# EAGLE design 30x70-motor-controller (EAGLE 7.7.0)

## Sheet 1 of 2
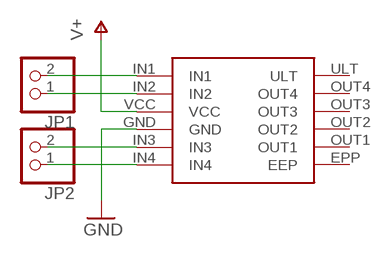
[diagram p0: schematic, sheet 1]

### Parts
JP1  PINHD-1X2/90  [1X02/90]
JP2  PINHD-1X2/90  [1X02/90]
U$1  DRV8833-MODULE  [DRV8833-BRKOUT]

### Nets
GND: U$1.GND ; also sheet 2
N$1: JP2.2 U$1.IN3
N$2: JP2.1 U$1.IN4
N$3: JP1.2 U$1.IN1
N$4: JP1.1 U$1.IN2
V+: U$1.VCC ; also sheet 2
Unconnected: U$1.EPP(EEP) U$1.OUT1 U$1.OUT2 U$1.OUT3 U$1.OUT4 U$1.ULT

## Sheet 2 of 2
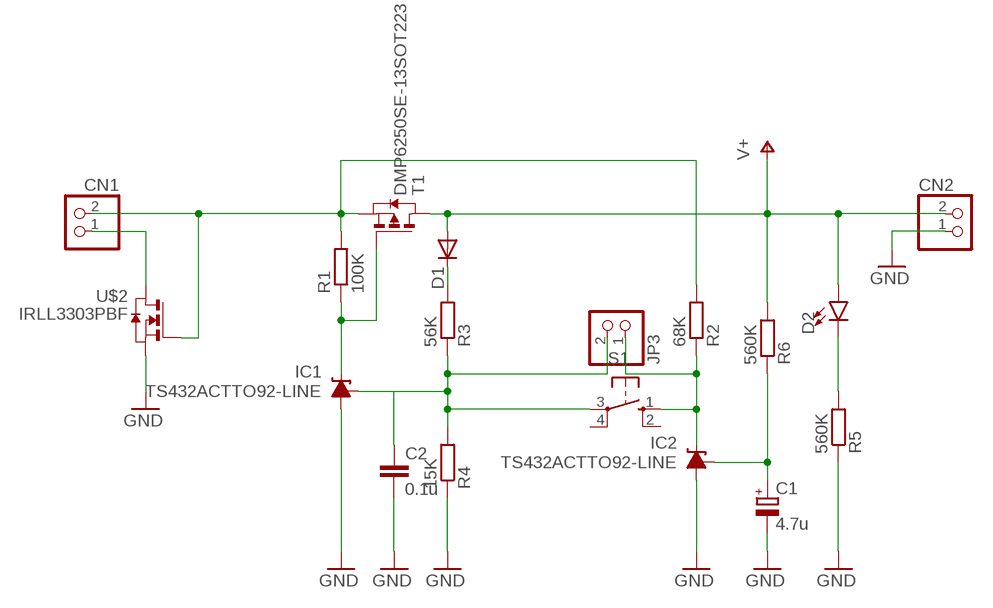
[diagram p1: schematic, sheet 2]

### Parts
C1  4.7u  CPOL-EUE2.5-5  [E2,5-5]
C2  0.1u  C-EU025-024X044  [C025-024X044]
CN1  JST_2PIN-THM-RA  [JST-PH-2-THM-RA]
CN2  JST_2PIN-THM-RA  [JST-PH-2-THM-RA]
D1  DIODE-D-2.5  [D-2.5]
D2  LED-3MM-NO_SILK  [LED_3MM-NS]
IC1  TS432ACTTO92-LINE  [TO92-LINE]
IC2  TS432ACTTO92-LINE  [TO92-LINE]
JP3  PINHD-1X2/90  [1X02/90]
R1  100K  R-EU_0204/5  [0204/5]
R2  68K  R-EU_0204/5  [0204/5]
R3  56K  R-EU_0204/5  [0204/5]
R4  15K  R-EU_0204/2V  [0204V]
R5  560K  R-EU_0204/5  [0204/5]
R6  560K  R-EU_0204/5  [0204/5]
S1  10-XX  [B3F-10XX]
T1  DMP6250SE-13SOT223  [SOT223]
U$2  IRLL3303PBF  [SOT223]

### Nets
GND: C1.- C2.2 CN2.1 IC1.2(A) IC2.2(A) R4.1 R5.1 U$2.3(S) ; also sheet 1
N$5: CN1.2 R1.2 R2.2 T1.3(S) U$2.1(G)
N$6: IC1.1(C) R1.1 T1.1(G)
N$7: CN1.1 U$2.2(D) U$2.4(D)
N$8: C2.1 IC1.3(FB) JP3.2 R3.1 R4.2 S1.3(P)
N$9: IC2.1(C) JP3.1 R2.1 S1.1(S)
N$10: C1.+ IC2.3(FB) R6.1
N$13: D1.C R3.2
N$17: D2.K(C) R5.2
V+: CN2.2 D1.A D2.A R6.2 T1.2(D) T1.4(D) ; also sheet 1
Unconnected: S1.2(S1) S1.4(P1)

## Library data of the parts
C1 = resistor:CPOL-EU: POLARIZED CAPACITOR, European symbol
C2 = resistor:C-EU: CAPACITOR, European symbol
CN1 CN2 = adafruit:JST_2PIN: JST 2-Pin Connectors of various flavors SMT-RA (S2B-PH-SM4) 4UConnector #17311 SMT (B2B-PH-SM4) THM-RA (S2B-PH) THM (B2B-PH)
D1 = diode:DIODE-: DIODE
D2 = SparkFun-LED:LED: LED (Generic) Standard schematic elements and footprints for 5mm, 3mm, 1206, and 0603 sized LEDs. Generic LEDs with no color specified.
IC1 IC2 = assorted:TS432ACT
JP1-JP3 = pinhead:PINHD-1X2: PIN HEADER
R1-R6 = resistor:R-EU_: RESISTOR, European symbol
S1 = switch-omron:10-XX: OMRON SWITCH; MPN: B3F-1000; OC_FARNELL: 176432; OC_NEWARK: 36M3542
T1 = assorted:DMP6250SE-13
U$1 = assorted:DRV8833-MODULE
U$2 = assorted:IRLL3303PBF

## Board
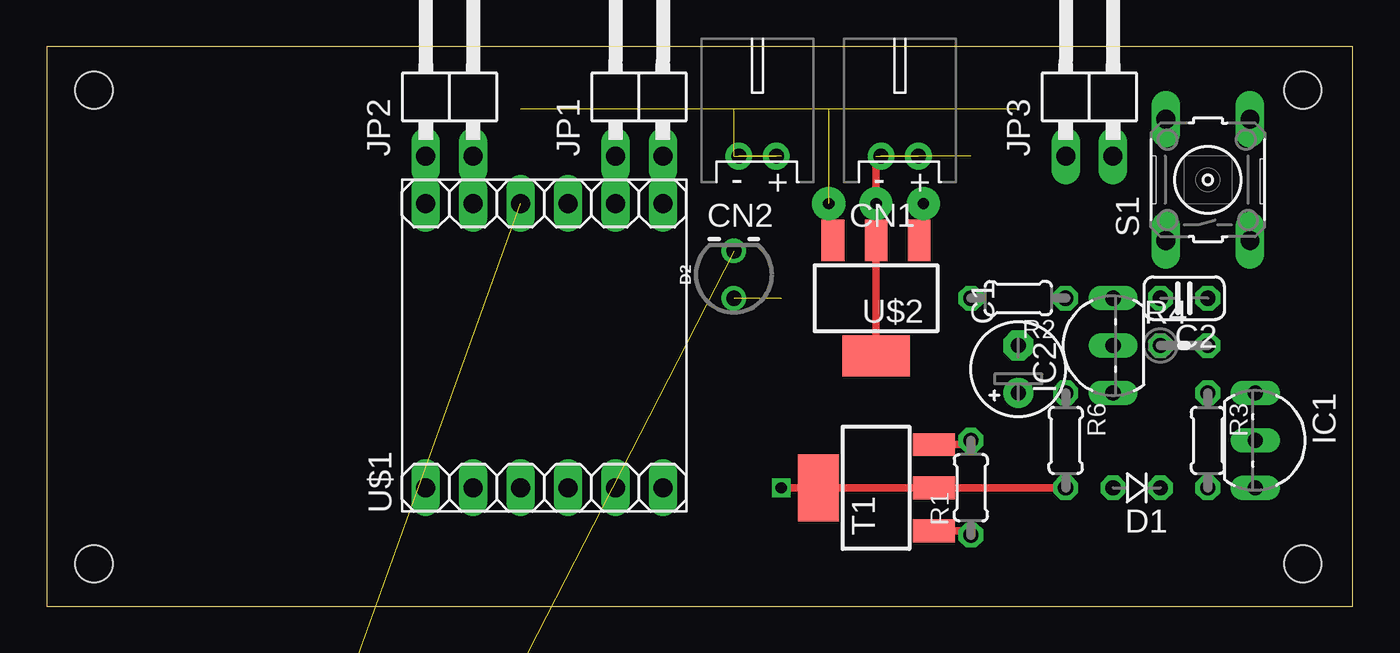
[diagram p2: board, top side]
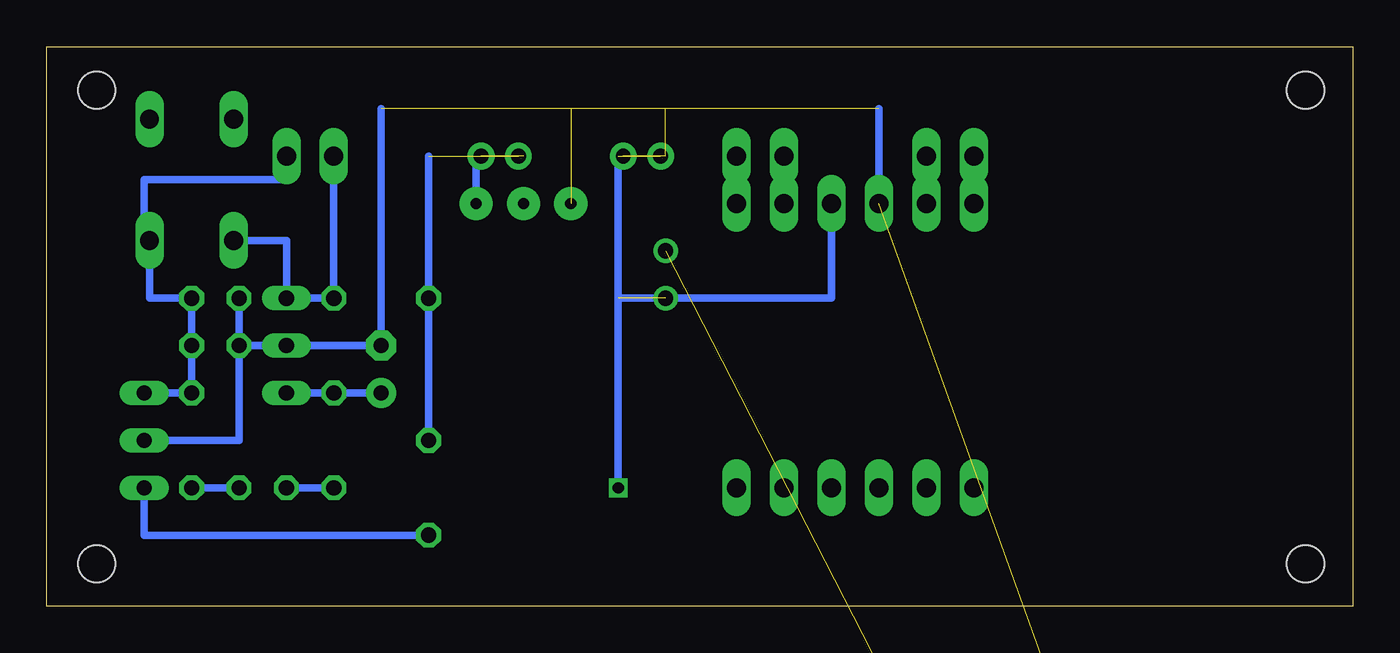
[diagram p3: board, bottom side, seen from below]

Size 70 x 30 mm. Coordinates in mm from the lower left corner, seen from the top.
Outline: 0,0 70,0 70,30 0,30 0,0
Copper layers (1*16): Top 0.035mm / dielectric 1.5mm / Bottom 0.035mm
Design rules "default": minimum track width 10mil, minimum drill 24mil, track to track 8mil, track to pad 8mil, pad to pad 8mil, via to via 8mil, smd to smd 8mil, copper to edge 40mil, drill to drill 8mil, minimum pad ring 10mil, minimum via ring 8mil, stop-mask expansion 4mil, vias tented up to drill 0mil, thermal gap 10mil
Holes 2 mm at 2.54,27.67 67.31,27.67 67.31,2.27 2.54,2.27

### Footprints (pad centres in the part's own frame; a part is rotated, then mirrored left to right if it is on the bottom)
E2,5-5 = drill 0.813 pad 1.6: + -1.27,0 | drill 0.813 pad 1.6 octagon: - 1.27,0
C025-024X044 = drill 0.813 octagon: 1 -1.27,0; 2 1.27,0
JST-PH-2-THM-RA = drill 0.8 pad 1.422: 1 1,0; 2 -1,0
D-2.5 = drill 0.813 octagon: A 1.27,0; C -1.27,0
LED_3MM-NS = drill 0.813: A -1.27,0; K 1.27,0
TO92-LINE = drill 0.813 long: 1 2.54,0; 2 0,0; 3 -2.54,0
1X02/90 = drill 1.016 long: 1 -1.27,-3.81; 2 1.27,-3.81
0204/5 = drill 0.813 octagon: 1 -2.54,0; 2 2.54,0
0204V = drill 0.813 octagon: 1 -1.27,0; 2 1.27,0
B3F-10XX = drill 1.016 long: 1 -3.251,2.261; 2 3.251,2.261; 3 -3.251,-2.261; 4 3.251,-2.261
SOT223 = smd 1.219 x 2.235: 1 -2.311,-3.099; 2 0,-3.099; 3 2.311,-3.099 | smd 3.6 x 2.2: 4 0,3.099
DRV8833-BRKOUT = drill 1.016 long: EPP -7.62,6.35; GND 7.62,1.27; IN1 7.62,-6.35; IN2 7.62,-3.81; IN3 7.62,3.81; IN4 7.62,6.35; OUT1 -7.62,3.81; OUT2 -7.62,1.27; OUT3 -7.62,-1.27; OUT4 -7.62,-3.81; ULT -7.62,-6.35; VCC 7.62,-1.27

### Placement (x,y rotation side)
C1  52.07,12.7 90 top
C2  60.96,16.51 180 top
CN1  45.72,24.13 0 top
CN2  38.1,24.13 0 top
D1  58.42,6.35 180 top
D2  36.83,17.78 90 top
IC1  64.77,8.89 270 top
IC2  57.15,13.97 90 top
JP1  31.75,27.94 0 top
JP2  21.59,27.94 0 top
JP3  55.88,27.94 0 top
R1  49.53,6.35 90 top
R2  52.07,16.51 180 top
R3  62.23,8.89 270 top
R4  60.96,13.97 0 top
R5  10.16,-27.94 0 top  (outside the outline)
R6  54.61,8.89 270 top
S1  62.23,22.86 90 top
T1  44.45,6.35 90 top
U$1  26.67,13.97 90 top
U$2  44.45,16.51 180 top

### Tracks (layer width: path | path; a pad name or v marks a point on that pad's centre or on a via)
GND  (via drill 0.6 pad 1.78)  (7 unrouted)
  Top 0.406: U$2.3 41.91,19.61 v41.91,21.59
  Bottom 0.406: IC2.2 C1.- | C2.2 R4.1 | R4.1 C1.- | R4.1 59.69,8.89 IC1.2 | 52.07,26.67 C1.- | U$1.GND 25.4,26.67
N$1
  Bottom 0.406: JP2.2 U$1.IN3
N$2
  Bottom 0.406: JP2.1 U$1.IN4
N$3
  Bottom 0.406: JP1.2 U$1.IN1
N$4
  Bottom 0.406: JP1.1 U$1.IN2
N$5  (via drill 0.6 pad 1.78)  (2 unrouted)
  Top 0.406: T1.3 49.53,8.66 R1.2 | 46.72,19.61 U$2.1 46.99,19.61 v46.99,21.59
  Bottom 0.406: 49.53,24.13 R2.2 R1.2 | 46.99,24.13 v46.99,21.59
N$6
  Top 0.406: T1.1 49.53,4.04 R1.1
  Bottom 0.406: R1.1 64.77,3.81 IC1.1
N$7  (via drill 0.6 pad 1.78)  (1 unrouted)
  Top 0.406: U$2.4 U$2.2 v44.45,21.59 44.45,24.13
N$8
  Bottom 0.406: JP3.2 57.15,22.86 64.77,22.86 64.77,19.61 S1.3 64.49,16.51 C2.1 R4.2 R3.1 IC1.3
N$9
  Bottom 0.406: S1.1 57.15,19.61 IC2.1 R2.1 JP3.1
N$10
  Bottom 0.406: IC2.3 C1.+ R6.1
N$13
  Bottom 0.406: D1.C R3.2
N$17  (1 unrouted)
V+  (via drill 0.6)  (2 unrouted)
  Top 0.406: 40.64,6.35 v39.37,6.35 T1.4 T1.2 R6.2
  Bottom 0.406: U$1.VCC 27.94,16.51 39.37,16.51 | 39.37,16.51 39.37,24.13 | 39.37,16.51 v39.37,6.35 | D1.A R6.2